# Altium schematic sheet cpu.SchDoc
size A4; Author: 上海擅韬信息技术有限公司
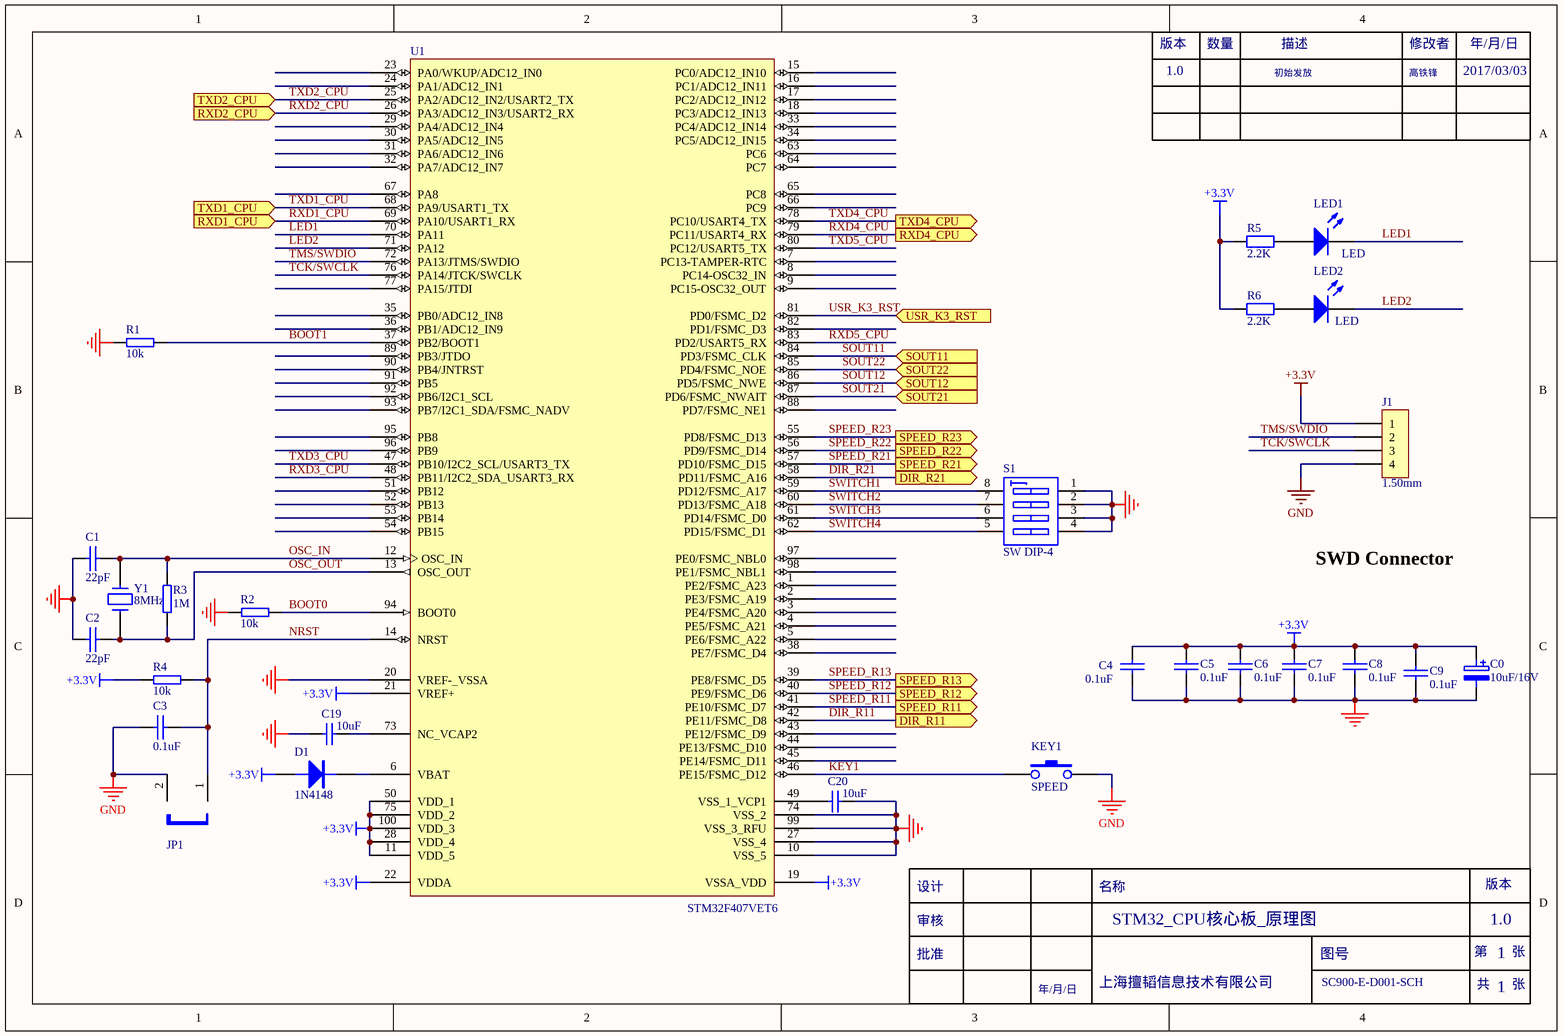
[diagram p0: cpu.SchDoc]

## Parts
C0  10uF/16V  [CASE-A_3216]
C1  22pF  [0805_CAP]
C2  22pF  [0805_CAP]
C3  0.1uF  [0805_CAP]
C4  0.1uF  [0805_CAP]
C5  0.1uF  [0805_CAP]
C6  0.1uF  [0805_CAP]
C7  0.1uF  [0805_CAP]
C8  0.1uF  [0805_CAP]
C9  0.1uF  [0805_CAP]
C19  10uF  [0805_CAP]
C20  10uF  [0805_CAP]
D1  1N4148  [LL-34(玻璃二极管)]
J1  1.50mm  [PH1.5_4P]
JP1  JUMPER  [SIP2]  (value not drawn)
KEY1  SPEED  [SW_PB_SMD_6X6]
LED1  LED  [0805-LED-R]
LED2  LED  [0805-LED-R]
R1  10k  [0805_RES]
R2  10k  [0805_RES]
R3  1M  [0805_RES]
R4  10k  [0805_RES]
R5  2.2K  [0805_RES]
R6  2.2K  [0805_RES]
S1  SW DIP-4  [SOP8_switch]
U1  STM32F407VET6  [LQFP100_14x14]
Y1  8MHz  [XTAL_US1]

## Ports
DIR_R11 (out), DIR_R21 (out), RXD1_CPU (in), RXD2_CPU (in), RXD4_CPU (out), SOUT11 (in), SOUT12 (in), SOUT21 (in), SOUT22 (in), SPEED_R11 (out), SPEED_R12 (out), SPEED_R13 (out), SPEED_R21 (out), SPEED_R22 (out), SPEED_R23 (out), TXD1_CPU (in), TXD2_CPU (in), TXD4_CPU (out), USR_K3_RST (in)

## Nets
+3.3V: C0.1 C4.1 C5.1 C6.1 C7.1 C8.1 C9.1 D1.1(A) J1.1 R4.1 R5.2 R6.2 U1.11(VDD_5) U1.19(VSSA_VDD) U1.21(VREF+) U1.22(VDDA) U1.28(VDD_4) U1.50(VDD_1) U1.75(VDD_2) U1.100(VDD_3)
GND: C0.2 C1.1 C2.1 C3.1 C4.2 C5.2 C6.2 C7.2 C8.2 C9.2 C19.2 C20.1 J1.4 JP1.2 KEY1.2 R1.1 R2.1 S1.1(A1) S1.2(A2) S1.3(A3) S1.4(A4) U1.10(VSS_5) U1.20(VREF-_VSSA) U1.27(VSS_4) U1.74(VSS_2) U1.99(VSS_3_RFU)
BOOT0: R2.2 U1.94(BOOT0)
BOOT1: R1.2 U1.37(PB2/BOOT1)
DIR_R11: U1.42(PE11/FSMC_D8) ; port DIR_R11
DIR_R21: U1.58(PD11/FSMC_A16) ; port DIR_R21
KEY1: KEY1.1 U1.46(PE15/FSMC_D12)
LED1: LED1.2(K) U1.70(PA11)
LED2: LED2.2(K) U1.71(PA12)
NRST: C3.2 JP1.1 R4.2 U1.14(NRST)
OSC_IN: C1.2 R3.2 U1.12(OSC_IN) Y1.2
OSC_OUT: C2.2 R3.1 U1.13(OSC_OUT) Y1.1
RXD1_CPU: U1.69(PA10/USART1_RX) ; port RXD1_CPU
RXD2_CPU: U1.26(PA3/ADC12_IN3/USART2_RX) ; port RXD2_CPU
RXD3_CPU: U1.48(PB11/I2C2_SDA_USART3_RX)
RXD4_CPU: U1.79(PC11/USART4_RX) ; port RXD4_CPU
RXD5_CPU: U1.83(PD2/USART5_RX)
SOUT11: U1.84(PD3/FSMC_CLK) ; port SOUT11
SOUT12: U1.86(PD5/FSMC_NWE) ; port SOUT12
SOUT21: U1.87(PD6/FSMC_NWAIT) ; port SOUT21
SOUT22: U1.85(PD4/FSMC_NOE) ; port SOUT22
SPEED_R11: U1.41(PE10/FSMC_D7) ; port SPEED_R11
SPEED_R12: U1.40(PE9/FSMC_D6) ; port SPEED_R12
SPEED_R13: U1.39(PE8/FSMC_D5) ; port SPEED_R13
SPEED_R21: U1.57(PD10/FSMC_D15) ; port SPEED_R21
SPEED_R22: U1.56(PD9/FSMC_D14) ; port SPEED_R22
SPEED_R23: U1.55(PD8/FSMC_D13) ; port SPEED_R23
SWITCH1: S1.8(B5) U1.59(PD12/FSMC_A17)
SWITCH2: S1.7(B6) U1.60(PD13/FSMC_A18)
SWITCH3: S1.6(A6) U1.61(PD14/FSMC_D0)
SWITCH4: S1.5(A5) U1.62(PD15/FSMC_D1)
TCK/SWCLK: J1.3 U1.76(PA14/JTCK/SWCLK)
TMS/SWDIO: J1.2 U1.72(PA13/JTMS/SWDIO)
TXD1_CPU: U1.68(PA9/USART1_TX) ; port TXD1_CPU
TXD2_CPU: U1.25(PA2/ADC12_IN2/USART2_TX) ; port TXD2_CPU
TXD3_CPU: U1.47(PB10/I2C2_SCL/USART3_TX)
TXD4_CPU: U1.78(PC10/USART4_TX) ; port TXD4_CPU
TXD5_CPU: U1.80(PC12/USART5_TX)
USR_K3_RST: U1.81(PD0/FSMC_D2) ; port USR_K3_RST
NetC19_1: C19.1 U1.73(NC_VCAP2)
NetC20_2: C20.2 U1.49(VSS_1_VCP1)
NetD1_2: D1.2(K) U1.6(VBAT)
NetLED1_1: LED1.1(A) R5.1
NetLED2_1: LED2.1(A) R6.1

Not connected (* = marked no-connect by the designer): U1 1(PE2/FSMC_A23) 2(PE3/FSMC_A19) 3(PE4/FSMC_A20) 4(PE5/FSMC_A21) 5(PE6/FSMC_A22) 7(PC13-TAMPER-RTC) 8(PC14-OSC32_IN) 9(PC15-OSC32_OUT) 15(PC0/ADC12_IN10) 16(PC1/ADC12_IN11) 17(PC2/ADC12_IN12) 18(PC3/ADC12_IN13) 23(PA0/WKUP/ADC12_IN0) 24(PA1/ADC12_IN1) 29(PA4/ADC12_IN4) 30(PA5/ADC12_IN5) 31(PA6/ADC12_IN6) 32(PA7/ADC12_IN7) 33(PC4/ADC12_IN14) 34(PC5/ADC12_IN15) 35(PB0/ADC12_IN8) 36(PB1/ADC12_IN9) 38(PE7/FSMC_D4) 43(PE12/FSMC_D9) 44(PE13/FSMC_D10) 45(PE14/FSMC_D11) 51(PB12) 52(PB13) 53(PB14) 54(PB15) 63(PC6) 64(PC7) 65(PC8) 66(PC9) 67(PA8) 77(PA15/JTDI) 82(PD1/FSMC_D3) 88(PD7/FSMC_NE1) 89(PB3/JTDO) 90(PB4/JNTRST) 91(PB5) 92(PB6/I2C1_SCL) 93(PB7/I2C1_SDA/FSMC_NADV) 95(PB8) 96(PB9) 97(PE0/FSMC_NBL0) 98(PE1/FSMC_NBL1)

## Notes on the sheet
- 1.0
- 初始发放
- 高铁锋
- 2017/03/03
- SWD Connector
- STM32_CPU核心板_原理图
- SC900-E-D001-SCH
- 1
- 版本
- 数量
- 描述
- 修改者
- 年/月/日
- 设计
- 审核
- 名称
- 批准
- 图号
- 第
- 共
- 张

## Library data of the parts
C0 = ELECTRO2: Electrolytic Capacitor
C1-C9 = CAP: Capacitor
C19 C20 = 0805 100nF(104) 10% 50V: 贴片电容; ComponentLink1Description: 供应商链接; ComponentLink1URL: http://www.szlcsc.com/product/details_50686.html; Package: 0805; Supplier: LC; SuppliersPartNumber: C49678
D1 = DIODE: LL-34(玻璃二极管)
J1 = CON4: Connector
JP1 = JUMPER: 2.54间距，2P，单排插针
KEY1 = SW-KEY-2
LED1 LED2 = LED2: Typical RED, GREEN, YELLOW, AMBER GaAs LED; Published: 8-Jun-2000; LatestRevisionDate: 17-Jul-2002; LatestRevisionNote: Re-released for DXP Platform.; PackageDocument: Feb-2002; PackageReference: 3.2X1.6X1.1; Publisher: Altium Limited
R1-R4 = RES
R5 R6 = Res2: Resistor; Published: 8-Jun-2000; LatestRevisionDate: 17-Jul-2002; LatestRevisionNote: Re-released for DXP Platform.; PackageReference: AXIAL-0.4; Publisher: Altium Limited; Value: 2.2K
S1 = SW DIP-4: DIP Switch
U1 = STM32F2xx_100: STM32 ARM-based 32-bit MCU with 64 Kbytes Flash, 100-pin LQFP, Industrial Temperature
Y1 = CRYSTAL